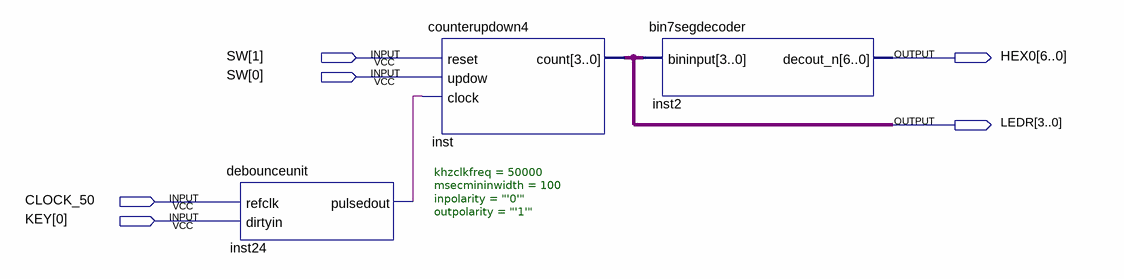
[diagram p0: schematic sheet]
// Quartus schematic Counter_Demo.bdf as structural Verilog: 3 symbols, 6 pins
module Counter_Demo (
  input  [1:0] SW,
  input  CLOCK_50,
  input  [0:0] KEY,
  output [6:0] HEX0,
  output [3:0] LEDR
);

  wire inst24_pulsedout;

  debounceunit #(.khzclkfreq(50000), .msecmininwidth(100), .inpolarity("'0'"), .outpolarity("'1'")) inst24 (
    .refclk(CLOCK_50), .dirtyin(KEY[0]), .pulsedout(inst24_pulsedout));
  counterupdown4 inst (.reset(SW[1]), .updow(SW[0]), .clock(inst24_pulsedout), .count(LEDR));
  bin7segdecoder inst2 (.bininput(LEDR), .decout_n(HEX0));
endmodule
